# Altium project ring_rx_v3_controller.PrjPcb
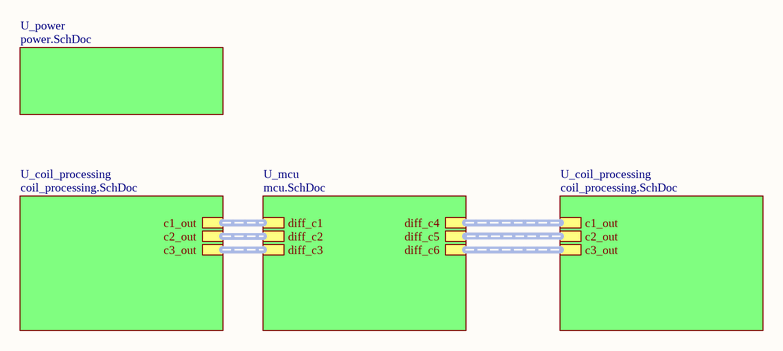
[diagram p0: rx.SchDoc]
5 sheets, 126 parts. Net scope: hierarchical (ports join the sheet entries above them; power ports are global).
Board file: ring_rx_v3_controller.PcbDoc
Sheets:
  rx.SchDoc
    U_power = power.SchDoc
    U_mcu = mcu.SchDoc
    U_coil_processing = coil_processing.SchDoc
      c1 = coils.SchDoc
      c2 = coils.SchDoc
      c3 = coils.SchDoc
    U_coil_processing = coil_processing.SchDoc
      c1 = coils.SchDoc
      c2 = coils.SchDoc
      c3 = coils.SchDoc

## Sheet rx.SchDoc
size A

### Sub-sheets
U_coil_processing = coil_processing.SchDoc: c2_out (harness diff_signal), c3_out (harness diff_signal), c1_out (harness diff_signal)
U_coil_processing = coil_processing.SchDoc: c2_out (harness diff_signal), c3_out (harness diff_signal), c1_out (harness diff_signal)
U_mcu = mcu.SchDoc: diff_c1 (harness diff_signal), diff_c2 (harness diff_signal), diff_c3 (harness diff_signal), diff_c4 (harness diff_signal), diff_c5 (harness diff_signal), diff_c6 (harness diff_signal)
U_power = power.SchDoc: no entries

### Buses and harness runs
harness sheet U_coil_processing/c1_out = sheet U_mcu/diff_c1
harness sheet U_coil_processing/c1_out = sheet U_mcu/diff_c4
harness sheet U_coil_processing/c2_out = sheet U_mcu/diff_c2
harness sheet U_coil_processing/c2_out = sheet U_mcu/diff_c5
harness sheet U_coil_processing/c3_out = sheet U_mcu/diff_c3
harness sheet U_coil_processing/c3_out = sheet U_mcu/diff_c6

## Sheet power.SchDoc
size A
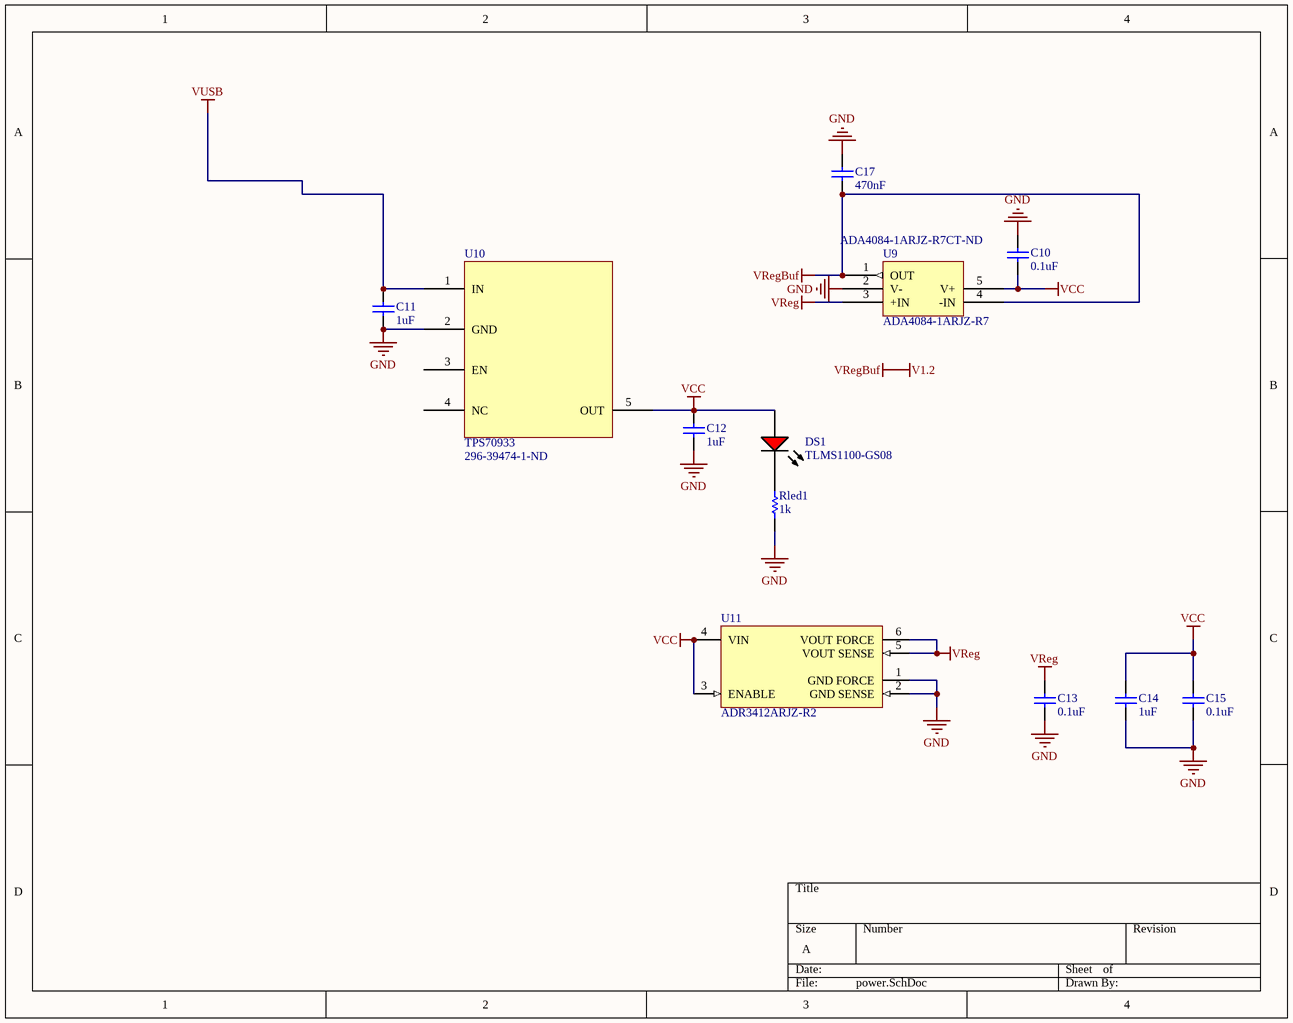
[diagram p1: power.SchDoc]

### Parts
C10  value 0.1uF  [0402]  (hidden comment: Cap)
C11  value 1uF  [0402]  (hidden comment: Cap)
C12  value 1uF  [0402]  (hidden comment: Cap)
C13  value 0.1uF  [0402]  (hidden comment: Cap)
C14  value 1uF  [0402]  (hidden comment: Cap)
C15  value 0.1uF  [0402]  (hidden comment: Cap)
C17  value 470nF  [0402]  (hidden comment: Cap)
DS1  TLMS1100-GS08  [VISH-TLMX1100_V]
Rled1  value 1k  [0402]  (hidden comment: Res)
U9  ADA4084-1ARJZ-R7  Supplier Part Number 1: ADA4084-1ARJZ-R7CT-ND  [SOT95P280X145-5N]
U10  TPS70933  Supplier Part Number 1: 296-39474-1-ND  [SOT95P280X145-5N]
U11  ADR3412ARJZ-R2  [ADI-RJ-6_N]

### Nets
GND: C10.2 C11.2 C12.2 C13.1 C14.2 C15.1 C17.2 Rled1.1 U9.2(V-) U10.2(GND) U11.1(GND_FORCE) U11.2(GND_SENSE)
V1.2: C17.1 U9.1(OUT) U9.4(-IN)  [also labelled VRegBuf]
VCC: C10.1 C12.1 C14.1 C15.2 DS1.1(A) U9.5(V+) U10.5(OUT) U11.3(ENABLE) U11.4(VIN)
VReg: C13.2 U9.3(+IN) U11.5(VOUT_SENSE) U11.6(VOUT_FORCE)
VUSB: C11.1 U10.1(IN)
NetDS1_2: DS1.2(K) Rled1.2

Not connected (* = marked no-connect by the designer): U10 3(EN) 4(NC)

### Library data of the parts
C10-C15 C17 = Cap: Ceramic Capacitor (Surface Mount); Manufacturer: Generic Ceramic Chip Cap (TBD); Digi-Key Part Number: *; Manufacturer Part Number: *; Note: *; Rating: *
DS1 = CMP-1666-00027-1: LED, RED, 2.1 V, -40 to 100 degC, 2-Pin SMD (0603), RoHS, Tape and Reel; Type (Capacitors): C0G; Resistance: 100000000000 Ohm; Capacitance: 12 pF; Voltage Rating: 50 V; Tolerance: 5%; Min Operating Temperature: -55degC; REACH SVHC: No SVHC; ComponentLink2Description: Datasheet; ComponentLink1URL: http://www.vishay.com/; Width: 0.8 mm; Package Quantity: 4000; PackageReference: TLMX1100; ComponentLink2URL: http://www.vishay.com/docs/83173/tlmb1100.pdf; Case/Package: 0603; Case Code (Metric): 1608; Packaging: Tape and Reel; Pins: 2; ComponentLink1Description: Manufacturer URL; Max Operating Temperature: 125degC; Height: 0.8 mm; Length: 1.6 mm; Mount: Surface Mount; PackageDescription: 2-Pin Surface Mount Device, Body 1.6 x 0.8 mm; DatasheetVersion: Rev. 2.7, 03/2016; Case Code (Imperial): 0603; Voltage Rating (DC): 50 V; RoHSCompliant: True; Radiation Hardening: No
Rled1 = Res: Chip Resistor (Surface Mount); Manufacturer: Generic Chip Res (TBD); Manufacturer Part Number: *; Digi-Key Part Number: *; Rating: *
U9 = ADA4622-1ARJZ: 30 V, 8 MHz, Low Bias Current, / Single-Supply, RRO, Precision Op Amps; ComponentLink1Description: Datasheet; ComponentLink1URL: http://www.analog.com/media/en/technical-documentation/data-sheets/ada4622-1-4622-2-4622-4.pdf; Supplier 1: Digi-Key
U10 = TPS70933: 3.3V Ultra low power Voltage Regulator; Supplier 1: Digi-Key
U11 = CMP-0784-00363-1: Micropower, High Accuracy Voltage Reference, 1.2 V Output, 2.3 to 5.5 V Supply, Industrial, 6-pin SOT23 (RJ-6), Reel; Manufacturer: Analog Devices; Vout: 1.2V; Max V Supply (V): 5.5; Min V Supply (V): 2.3; Ref Out TC (ppm/C): 8; Mounting Technology: Surface Mount; DatasheetVersion: Rev. B; Code_JEDEC: MO-178-AB; ComponentLink3URL: http://www.analog.com/static/imported-files/packages/PKG_PDF/SOT-23(RJ)/RJ_6.pdf; ComponentLink2Description: Datasheet; ComponentLink1URL: http://www.analog.com/en/index.html; ComponentLink2URL: http://www.analog.com/static/imported-files/data_sheets/ADR3412_ADR3420_ADR3425_ADR3430_ADR3433_ADR3440_ADR3450.pdf; Packing: Reel; ComponentLink4Description: URL Link1; Operating Temp Range: -40 to 125 degC; ComponentLink4URL: Product URL:http://www.analog.com/en/special-linear-functions/voltage-references/adr3412/products/product.html; ComponentLink3Description: Package Specification; PartNumber: ADR3412ARJZ-R2; PackageReference: RJ-6; PackageVersion: 121608-A, 12/2008; ComponentLink1Description: Manufacturer URL; PackageDescription: 6-Pin Small Outline Transistor Package, Body 2.9 x 1.6 mm, Pitch 0.95 mm

## Sheet mcu.SchDoc
size A
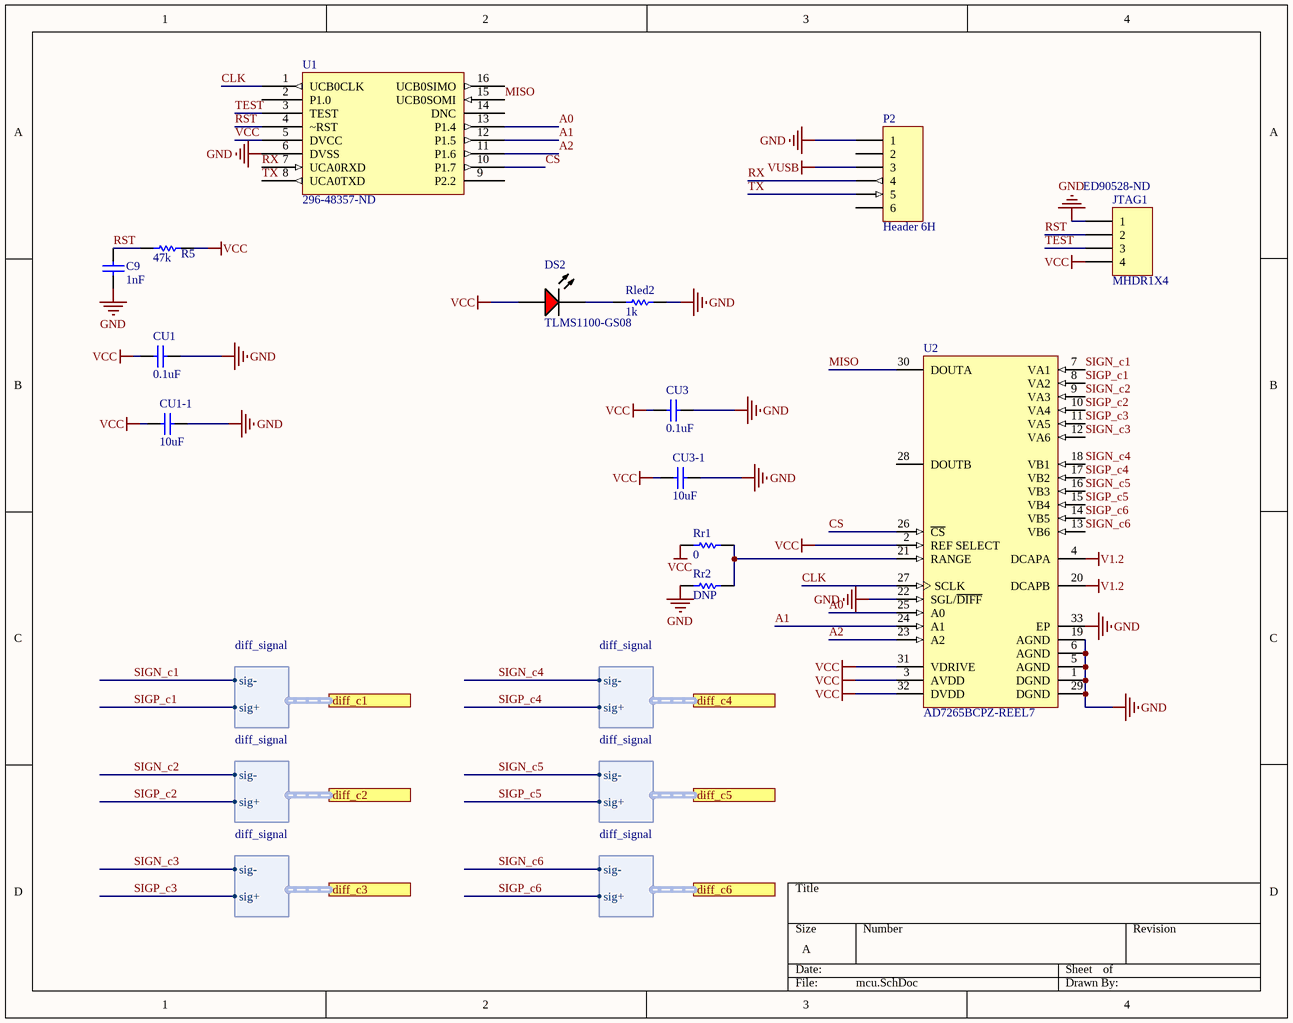
[diagram p2: mcu.SchDoc]

### Parts
C9  value 1nF  [0402]  (hidden comment: Cap)
CU1  value 0.1uF  [0402]  (hidden comment: Cap)
CU1-1  value 10uF  [0402]  (hidden comment: Cap)
CU3  value 0.1uF  [0402]  (hidden comment: Cap)
CU3-1  value 10uF  [0402]  (hidden comment: Cap)
DS2  TLMS1100-GS08  [VISH-TLMX1100_V]
JTAG1  MHDR1X4  Supplier Part Number 1: ED90528-ND  [MHDR1X4]
P2  Header 6H  [HDR1X6H]
R5  value 47k  [0402]  (hidden comment: Res)
Rled2  value 1k  [0402]  (hidden comment: Res)
Rr1  value 0  [0402]  (hidden comment: Res)
Rr2  value DNP  [0402]  (hidden comment: Res)
U1  Supplier Part Number 1: 296-48357-ND  [TSOP65P640X120-16N]  (hidden comment: MSP430FR2422)
U2  AD7265BCPZ-REEL7  [CP-32-2_M]

### Ports
diff_c1 (harness diff_signal), diff_c2 (harness diff_signal), diff_c3 (harness diff_signal), diff_c4 (harness diff_signal), diff_c5 (harness diff_signal), diff_c6 (harness diff_signal)

### Harnesses
diff_signal: sig+, sig-

### Nets
GND: C9.1 CU1.1 CU1-1.1 CU3.1 CU3-1.1 JTAG1.1 P2.1 Rled2.2 Rr2.1 U1.6(DVSS) U2.1(DGND) U2.5(AGND) U2.6(AGND) U2.19(AGND) U2.22(SGL/~{DIFF}) U2.29(DGND) U2.33(EP)
V1.2: U2.4(DCAPA) U2.20(DCAPB)
VCC: CU1.2 CU1-1.2 CU3.2 CU3-1.2 DS2.1(A) JTAG1.4 R5.2 Rr1.1 U1.5(DVCC) U2.2(REF_SELECT) U2.3(AVDD) U2.31(VDRIVE) U2.32(DVDD)
VUSB: P2.3
A0: U1.13(P1.4) U2.25(A0)
A1: U1.12(P1.5) U2.24(A1)
A2: U1.11(P1.6) U2.23(A2)
CLK: U1.1(UCB0CLK) U2.27(SCLK)
CS: U1.10(P1.7) U2.26(~{CS})
MISO: U1.15(UCB0SOMI) U2.30(DOUTA)
RST: C9.2 JTAG1.2 R5.1 U1.4(~RST)
RX: P2.4 U1.7(UCA0RXD)
SIGN_c1: U2.7(VA1) ; port diff_c1.sig-
SIGN_c2: U2.9(VA3) ; port diff_c2.sig-
SIGN_c3: U2.12(VA6) ; port diff_c3.sig-
SIGN_c4: U2.18(VB1) ; port diff_c4.sig-
SIGN_c5: U2.16(VB3) ; port diff_c5.sig-
SIGN_c6: U2.13(VB6) ; port diff_c6.sig-
SIGP_c1: U2.8(VA2) ; port diff_c1.sig+
SIGP_c2: U2.10(VA4) ; port diff_c2.sig+
SIGP_c3: U2.11(VA5) ; port diff_c3.sig+
SIGP_c4: U2.17(VB2) ; port diff_c4.sig+
SIGP_c5: U2.15(VB4) ; port diff_c5.sig+
SIGP_c6: U2.14(VB5) ; port diff_c6.sig+
TEST: JTAG1.3 U1.3(TEST)
TX: P2.5 U1.8(UCA0TXD)
NetDS2_2: DS2.2(K) Rled2.1
NetRr1_2: Rr1.2 Rr2.2 U2.21(RANGE)

Not connected (* = marked no-connect by the designer): P2 2 6; U1 2(P1.0) 9(P2.2) 14(DNC) 16(UCB0SIMO); U2 28(DOUTB)

### Library data of the parts
C9 CU1 CU1-1 CU3 CU3-1 = Cap: as C10 on sheet power; Digi-Key Part Number: *; Manufacturer Part Number: *; Note: *; Rating: *
DS2 = CMP-1666-00027-1: as DS1 on sheet power; Min Operating Temperature: -55degC; REACH SVHC: No SVHC; ComponentLink2Description: Datasheet; ComponentLink1URL: http://www.vishay.com/; Width: 0.8 mm; Package Quantity: 4000; PackageReference: TLMX1100; ComponentLink2URL: http://www.vishay.com/docs/83173/tlmb1100.pdf; Case/Package: 0603; Case Code (Metric): 1608; Packaging: Tape and Reel; Pins: 2; ComponentLink1Description: Manufacturer URL; Max Operating Temperature: 125degC; Height: 0.8 mm; Length: 1.6 mm; Mount: Surface Mount; PackageDescription: 2-Pin Surface Mount Device, Body 1.6 x 0.8 mm; DatasheetVersion: Rev. 2.7, 03/2016; Case Code (Imperial): 0603; Voltage Rating (DC): 50 V; RoHSCompliant: True; Radiation Hardening: No
JTAG1 = MHDR1X4: Header, 4-Pin; LatestRevisionDate: 17-Jul-2002; LatestRevisionNote: Re-released for DXP Platform.; Publisher: Altium Limited; Supplier 1: Digi-Key
P2 = Header 6H: Header, 6-Pin, Right Angle; LatestRevisionDate: 17-Jul-2002; LatestRevisionNote: Re-released for DXP Platform.; Publisher: Altium Limited
R5 Rled2 Rr1 Rr2 = Res: as Rled1 on sheet power; Manufacturer Part Number: *; Digi-Key Part Number: *; Rating: *
U1 = MSP430FR2422: MSP430FR2422 Mixed-Signal Microcontroller; Supplier 1: Digi-Key
U2 = CMP-0313-00283-2: 1Dual 12-Bit SAR Analog-to-Digital Converter with Serial, SPI Interface, 1MSPS, -40 to +125 degC, CP-32-2, Pb-Free, Reel; Generic Part Number: AD7265; Manufacturer: Analog Devices; Interface: Ser, SPI; Throughput Rate (SPS): 1M; Resolution (Bits): 12; DatasheetVersion: Rev.A; Packing: Reel; ComponentLink1Description: Manufacturer URL; RoHS: Y; ComponentLink2Description: Datasheet; ComponentLink4URL: http://www.analog.com/en/analog-to-digital-converters/ad-converters/ad7265/products/product.html; Channels: 12; ComponentLink1URL: http://www.analog.com/en/index.html; PackageVersion: Jan-2005; ComponentLink4Description: Product URL; ComponentLink3Description: Package Specification; ComponentLink3URL: http://www.analog.com/static/imported-files/packages/414143737956480539664569CP_32_2.pdf; PackageDescription: 32-Lead Lead Frame Chip Scale Package [LFCSP_VQ] 5 x 5 mm Body, Very Thin Quad; Code_JEDEC: MO-220-VHHD-2; PackageReference: CP-32-2; PartNumber: AD7265BCPZ-REEL7; ComponentLink2URL: http://www.analog.com/static/imported-files/data_sheets/AD7265.pdf; Mounting Technology: Surface Mount

## Sheet coil_processing.SchDoc
size A
Used 2 times, as channels U_coil_processing, U_coil_processing. Parts and nets are listed once, with the designators drawn on the sheet.
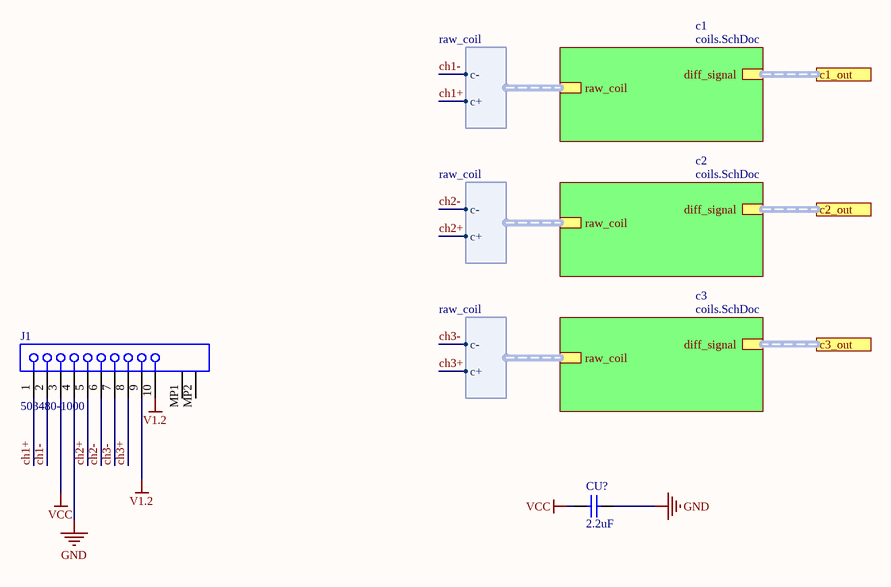
[diagram p3: coil_processing.SchDoc]

### Parts
CU?  value 2.2uF  [0402]  (hidden comment: Cap)
J1  503480-1000  [MOLX-503480-1000]

### Sub-sheets
c1 = coils.SchDoc: raw_coil (harness raw_coil), diff_signal (harness diff_signal)  | C1_val: 2200pF; C2_val: 100pF
c2 = coils.SchDoc: raw_coil (harness raw_coil), diff_signal (harness diff_signal)  | C1_val: 2200pF; C2_val: 100pF
c3 = coils.SchDoc: raw_coil (harness raw_coil), diff_signal (harness diff_signal)  | C1_val: 2200pF; C2_val: 100pF

### Ports
c1_out (harness diff_signal), c2_out (harness diff_signal), c3_out (harness diff_signal)

### Harnesses
raw_coil: c-, c+

### Nets
GND: CU?.1 J1.4
V1.2: J1.9 J1.10
VCC: CU?.2 J1.3
ch1+: J1.1 ; sheet c1/raw_coil.c+
ch1-: J1.2 ; sheet c1/raw_coil.c-
ch2+: J1.5 ; sheet c2/raw_coil.c+
ch2-: J1.6 ; sheet c2/raw_coil.c-
ch3+: J1.8 ; sheet c3/raw_coil.c+
ch3-: J1.7 ; sheet c3/raw_coil.c-

Not connected (* = marked no-connect by the designer): J1 MP1 MP2

### Channels
U_coil_processing: designators CU?=CU?_U_coil_processing#1 J1=J1_U_coil_processing2
U_coil_processing: designators CU?=CU?_U_coil_processing#2 J1=J1_U_coil_processing1

### Buses and harness runs
harness port c1_out = sheet c1/diff_signal
harness port c2_out = sheet c2/diff_signal
harness port c3_out = sheet c3/diff_signal

### Library data of the parts
CU? = Cap: as C10 on sheet power; Digi-Key Part Number: *; Manufacturer Part Number: *; Note: *; Rating: *
J1 = CMP-1241-00115-1: 0.5 mm Pitch Easy-On(TM) BackFlip(TM) Type FPC Connector, 1.0 mm Mated Height, Right Angle, SMT, Dual Contact, 10 Circuits, -40 to 85 degC, ELV and RoHS Compliant, Tape and Reel; Manufacturer: Molex; Durability (mating cycles max): 10; Pitch - Mating Interface: 0.50mm; Material - Plating Mating: Gold; Voltage (Max): 50V AC (RMS)/DC; Polarized to PCB: Yes; PCB Locator: No; Current (Max per Contact): 0.5A; Material - Plating Termination: Gold, Tin; Entry Angle: 90degrees Angle; Mated Height: 1.00mm; Material - Metal: Phosphor Bronze; ComponentLink1Description: Manufacturer URL; PartNumber: 503480-1000; Circuits (Loaded): 10; Packing: Tape and Reel; PackageReference: 503480-1000; ComponentLink2URL: http://www.molex.com/webdocs/datasheets/pdf/en-us/5034801000_FFC_FPC_CONNECTORS.pdf; PackageVersion: Rev. F, 09/2012; ComponentLink3Description: Package Specification; ComponentLink3URL: http://www.molex.com/pdm_docs/sd/5034801000_sd.pdf; PackageDescription: 10-Lead FPC Connector, Pitch 0.5 mm; Stackable: No; Mounting Technology: Surface Mount; ComponentLink2Description: Datasheet; PCB Retention: Yes; Number of Rows: 1; Orientation: Right Angle; Contact Position: Dual; RoHS: TRUE; ComponentLink1URL: http://www.molex.com/molex/index.jsp; System: Connector

## Sheet coils.SchDoc: Coils
size A
Used 6 times, as channels U_coil_processing/c1, U_coil_processing/c2, U_coil_processing/c3, U_coil_processing/c1, U_coil_processing/c2, U_coil_processing/c3. Parts and nets are listed once, with the designators drawn on the sheet.
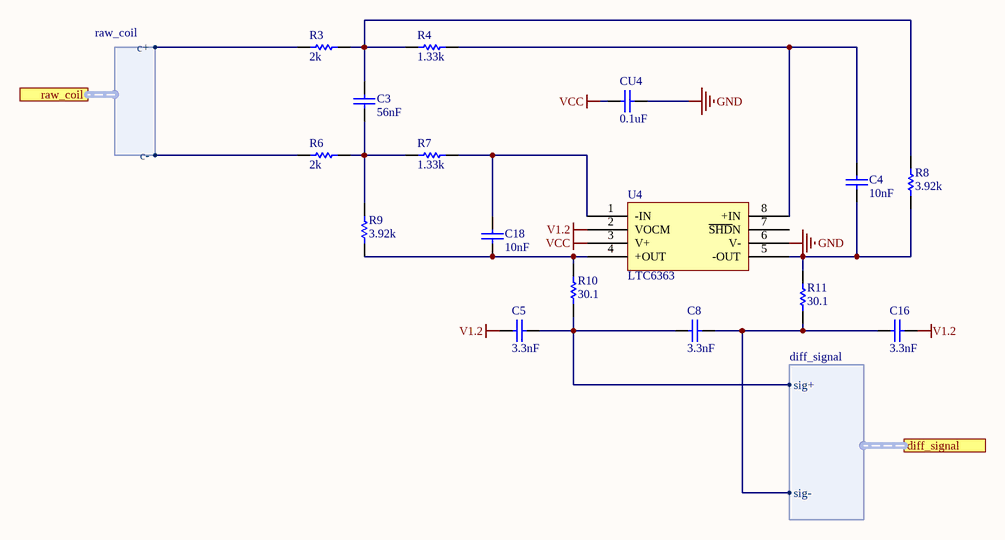
[diagram p4: coils.SchDoc]

### Parts
C3  value 56nF  [0402]  (hidden comment: Cap)
C4  value 10nF  [0402]  (hidden comment: Cap)
C5  value 3.3nF  [0402]  (hidden comment: Cap)
C8  value 3.3nF  [0402]  (hidden comment: Cap)
C16  value 3.3nF  [0402]  (hidden comment: Cap)
C18  value 10nF  [0402]  (hidden comment: Cap)
CU4  value 0.1uF  [0402]  (hidden comment: Cap)
R3  value 2k  [0402]  (hidden comment: Res)
R4  value 1.33k  [0402]  (hidden comment: Res)
R6  value 2k  [0402]  (hidden comment: Res)
R7  value 1.33k  [0402]  (hidden comment: Res)
R8  value 3.92k  [0402]  (hidden comment: Res)
R9  value 3.92k  [0402]  (hidden comment: Res)
R10  value 30.1  [0402]  (hidden comment: Res)
R11  value 30.1  [0402]  (hidden comment: Res)
U4  LTC6363  [TSOP65P490X110-8N - LTC6363]

### Ports
diff_signal (harness diff_signal), raw_coil (harness raw_coil)

### Harnesses
diff_signal: sig+, sig-
raw_coil: c-, c+

### Nets
GND: CU4.1 U4.6(V-)
V1.2: C5.2 C16.1 U4.2(VOCM)
VCC: CU4.2 U4.3(V+)
NetC3_1: C3.1 R6.1 R7.2 R9.1
NetC3_2: C3.2 R3.1 R4.2 R8.1
NetC4_1: C4.1 R8.2 R11.1 U4.5(-OUT)
NetC4_2: C4.2 R4.1 U4.8(+IN)
NetC5_1: C5.1 C8.2 R10.2 ; port diff_signal.sig+
NetC8_1: C8.1 C16.2 R11.2 ; port diff_signal.sig-
NetC18_1: C18.1 R9.2 R10.1 U4.4(+OUT)
NetC18_2: C18.2 R7.1 U4.1(-IN)
NetR3_2: R3.2 ; port raw_coil.c+
NetR6_2: R6.2 ; port raw_coil.c-

Not connected (* = marked no-connect by the designer): U4 7(~{SHD}N)

### Channels
U_coil_processing/c1: designators end in _c12
U_coil_processing/c2: designators end in _c22
U_coil_processing/c3: designators C3=C3_c32 C4=C4_c32 C5=C5_c32 C8=C8_c32 C16=C16_c32 C18=C18_c32 CU4=CU4_c32 R3=R3_c32 R4=R4_c32 R6=R6_c32 R7=R7_c32 R8=R8_c32 R9=R9 R10=R10_c32 R11=R11_c32 U4=U4_c32
U_coil_processing/c1: designators end in _c11
U_coil_processing/c2: designators end in _c21
U_coil_processing/c3: designators end in _c31

### Library data of the parts
C3-C5 C8 C16 C18 CU4 = Cap: as C10 on sheet power
  CU4: Digi-Key Part Number: *; Manufacturer Part Number: *; Note: *; Rating: *
R3 R4 R6-R11 = Res: as Rled1 on sheet power; Manufacturer Part Number: *; Digi-Key Part Number: *; Rating: *

## Nets that join several sheets
GND: power (12 pins), mcu (17 pins), U_coil_processing (CU?_U_coil_processing#1.1 J1_U_coil_processing2.4), U_coil_processing/c1 (CU4_c12.1 U4_c12.6), U_coil_processing/c2 (CU4_c22.1 U4_c22.6), U_coil_processing/c3 (CU4_c32.1 U4_c32.6), U_coil_processing (CU?_U_coil_processing#2.1 J1_U_coil_processing1.4), U_coil_processing/c1 (CU4_c11.1 U4_c11.6), U_coil_processing/c2 (CU4_c21.1 U4_c21.6), U_coil_processing/c3 (CU4_c31.1 U4_c31.6)
V1.2: power (C17.1 U9.1 U9.4), mcu (U2.4 U2.20), U_coil_processing (J1_U_coil_processing2.9 J1_U_coil_processing2.10), U_coil_processing/c1 (C5_c12.2 C16_c12.1 U4_c12.2), U_coil_processing/c2 (C5_c22.2 C16_c22.1 U4_c22.2), U_coil_processing/c3 (C5_c32.2 C16_c32.1 U4_c32.2), U_coil_processing (J1_U_coil_processing1.9 J1_U_coil_processing1.10), U_coil_processing/c1 (C5_c11.2 C16_c11.1 U4_c11.2), U_coil_processing/c2 (C5_c21.2 C16_c21.1 U4_c21.2), U_coil_processing/c3 (C5_c31.2 C16_c31.1 U4_c31.2)
VCC: power (9 pins), mcu (13 pins), U_coil_processing (CU?_U_coil_processing#1.2 J1_U_coil_processing2.3), U_coil_processing/c1 (CU4_c12.2 U4_c12.3), U_coil_processing/c2 (CU4_c22.2 U4_c22.3), U_coil_processing/c3 (CU4_c32.2 U4_c32.3), U_coil_processing (CU?_U_coil_processing#2.2 J1_U_coil_processing1.3), U_coil_processing/c1 (CU4_c11.2 U4_c11.3), U_coil_processing/c2 (CU4_c21.2 U4_c21.3), U_coil_processing/c3 (CU4_c31.2 U4_c31.3)
VUSB: power (C11.1 U10.1), mcu (P2.3)
ch1+_U_coil_processing: U_coil_processing (J1_U_coil_processing2.1), U_coil_processing/c1 (R3_c12.2)
ch1+_U_coil_processing: U_coil_processing (J1_U_coil_processing1.1), U_coil_processing/c1 (R3_c11.2)
ch1-_U_coil_processing: U_coil_processing (J1_U_coil_processing2.2), U_coil_processing/c1 (R6_c12.2)
ch1-_U_coil_processing: U_coil_processing (J1_U_coil_processing1.2), U_coil_processing/c1 (R6_c11.2)
ch2+_U_coil_processing: U_coil_processing (J1_U_coil_processing2.5), U_coil_processing/c2 (R3_c22.2)
ch2+_U_coil_processing: U_coil_processing (J1_U_coil_processing1.5), U_coil_processing/c2 (R3_c21.2)
ch2-_U_coil_processing: U_coil_processing (J1_U_coil_processing2.6), U_coil_processing/c2 (R6_c22.2)
ch2-_U_coil_processing: U_coil_processing (J1_U_coil_processing1.6), U_coil_processing/c2 (R6_c21.2)
ch3+_U_coil_processing: U_coil_processing (J1_U_coil_processing2.8), U_coil_processing/c3 (R3_c32.2)
ch3+_U_coil_processing: U_coil_processing (J1_U_coil_processing1.8), U_coil_processing/c3 (R3_c31.2)
ch3-_U_coil_processing: U_coil_processing (J1_U_coil_processing2.7), U_coil_processing/c3 (R6_c32.2)
ch3-_U_coil_processing: U_coil_processing (J1_U_coil_processing1.7), U_coil_processing/c3 (R6_c31.2)
SIGN_c1: mcu (U2.7), U_coil_processing/c1 (C8_c12.1 C16_c12.2 R11_c12.2)
SIGN_c2: mcu (U2.9), U_coil_processing/c2 (C8_c22.1 C16_c22.2 R11_c22.2)
SIGN_c3: mcu (U2.12), U_coil_processing/c3 (C8_c32.1 C16_c32.2 R11_c32.2)
SIGN_c4: mcu (U2.18), U_coil_processing/c1 (C8_c11.1 C16_c11.2 R11_c11.2)
SIGN_c5: mcu (U2.16), U_coil_processing/c2 (C8_c21.1 C16_c21.2 R11_c21.2)
SIGN_c6: mcu (U2.13), U_coil_processing/c3 (C8_c31.1 C16_c31.2 R11_c31.2)
SIGP_c1: mcu (U2.8), U_coil_processing/c1 (C5_c12.1 C8_c12.2 R10_c12.2)
SIGP_c2: mcu (U2.10), U_coil_processing/c2 (C5_c22.1 C8_c22.2 R10_c22.2)
SIGP_c3: mcu (U2.11), U_coil_processing/c3 (C5_c32.1 C8_c32.2 R10_c32.2)
SIGP_c4: mcu (U2.17), U_coil_processing/c1 (C5_c11.1 C8_c11.2 R10_c11.2)
SIGP_c5: mcu (U2.15), U_coil_processing/c2 (C5_c21.1 C8_c21.2 R10_c21.2)
SIGP_c6: mcu (U2.14), U_coil_processing/c3 (C5_c31.1 C8_c31.2 R10_c31.2)